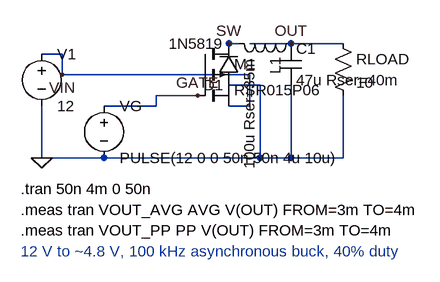
[diagram p0: schematic 12_buck_converter.asc]
12_buck_converter.asc, the LTspice schematic file:
Version 4
SHEET 1 880 680
WIRE 80 96 112 96
WIRE 112 96 112 128
WIRE 112 128 400 128
WIRE 400 128 400 176
WIRE 368 176 400 176
WIRE 80 176 80 256
WIRE 176 176 256 176
WIRE 256 160 256 176
WIRE 256 160 320 160
WIRE 176 256 176 256
WIRE 368 80 384 80
WIRE 368 144 416 144
WIRE 416 144 416 256
WIRE 400 80 464 80
WIRE 464 80 544 80
WIRE 464 144 464 256
WIRE 544 160 544 256
WIRE 80 256 544 256
FLAG 80 256 0
FLAG 112 128 VIN
FLAG 320 160 GATE
FLAG 368 80 SW
FLAG 464 80 OUT
SYMBOL voltage 80 80 R0
SYMATTR InstName V1
SYMATTR Value 12
SYMBOL voltage 176 160 R0
SYMATTR InstName VG
SYMATTR Value PULSE(12 0 0 50n 50n 4u 10u)
SYMBOL pmos 320 80 R0
SYMATTR InstName M1
SYMATTR Value RSR015P06
SYMBOL diode 384 144 R180
SYMATTR InstName D1
SYMATTR Value 1N5819
SYMBOL ind 480 64 R90
SYMATTR InstName L1
SYMATTR Value 100u Rser=35m
SYMBOL cap 448 80 R0
SYMATTR InstName C1
SYMATTR Value 47u Rser=40m
SYMBOL res 528 64 R0
SYMATTR InstName RLOAD
SYMATTR Value 10
TEXT 48 304 Left 2 !.tran 50n 4m 0 50n
TEXT 48 336 Left 2 !.meas tran VOUT_AVG AVG V(OUT) FROM=3m TO=4m
TEXT 48 368 Left 2 !.meas tran VOUT_PP PP V(OUT) FROM=3m TO=4m
TEXT 48 400 Left 2 ;12 V to ~4.8 V, 100 kHz asynchronous buck, 40% duty

The netlist it stands for:
* 12_buck_converter.asc
V1 VIN 0 12
VG GATE 0 PULSE(12 0 0 50n 50n 4u 10u)
M1 SW GATE VIN VIN RSR015P06
D1 0 SW 1N5819
L1 OUT SW 100u Rser=35m
C1 OUT 0 47u Rser=40m
RLOAD OUT 0 10
.model D D
.lib standard.dio
.model NMOS NMOS
.model PMOS PMOS
.lib standard.mos
.tran 50n 4m 0 50n
.meas tran VOUT_AVG AVG V(OUT) FROM=3m TO=4m
.meas tran VOUT_PP PP V(OUT) FROM=3m TO=4m
* 12 V to ~4.8 V, 100 kHz asynchronous buck, 40% duty
.backanno
.end